# Altium schematic sheet power_SCH1.SchDoc
size B; Organization: CWRUbotix; Address1: 10900 Euclid Avenue; Address2: Cleveland, OH 44106; Address3: USA
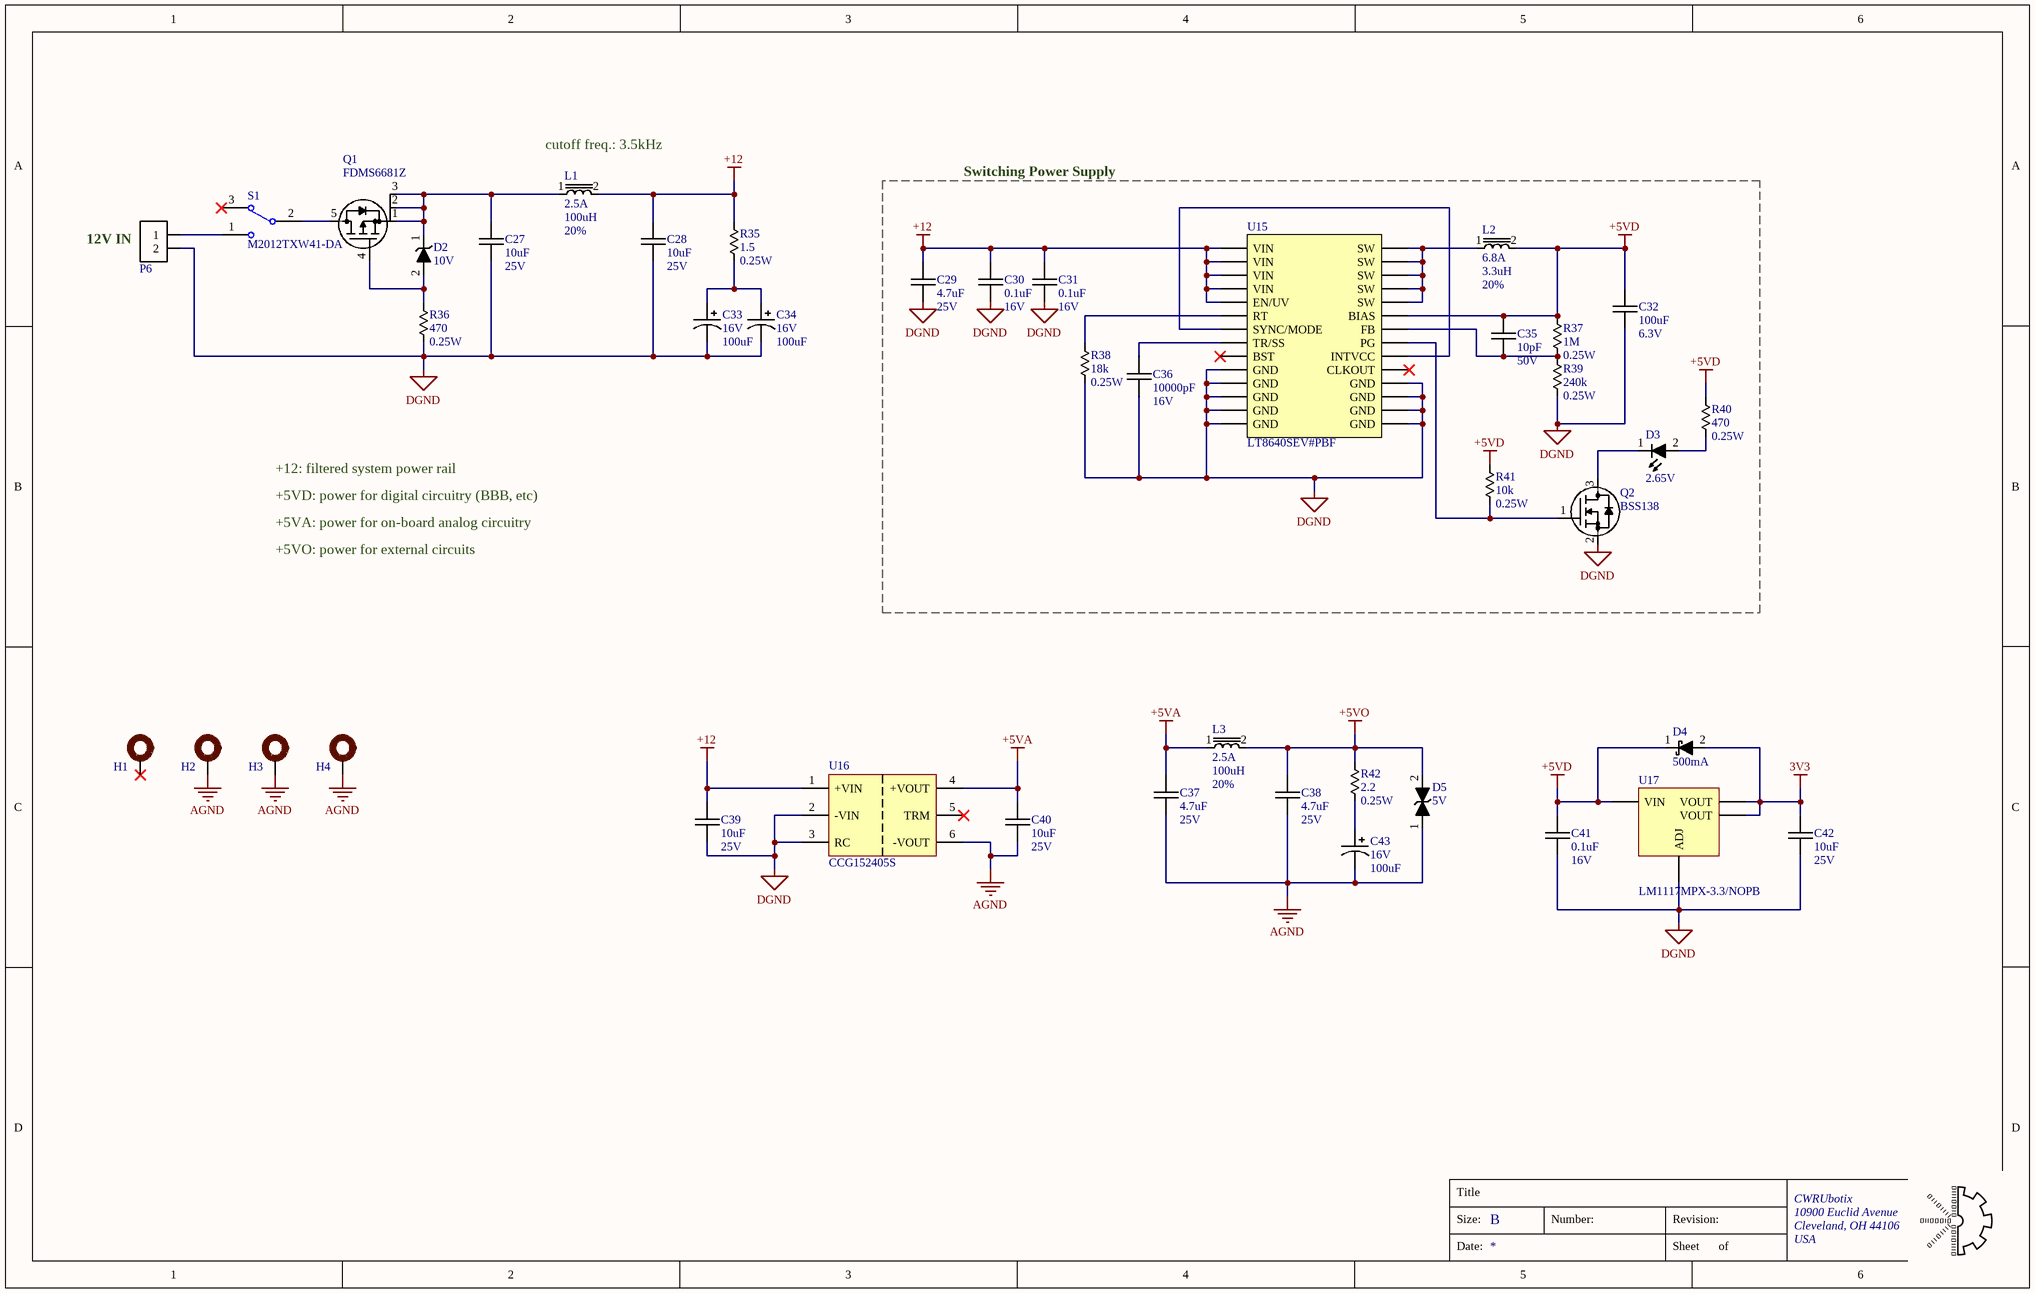
[diagram p0: power_SCH1.SchDoc]

## Parts
C27  Capacitance: 10uF  Voltage Rating: 25V  [chip_1206]  (hidden comment: cap_single_np)
C28  Capacitance: 10uF  Voltage Rating: 25V  [chip_1206]  (hidden comment: cap_single_np)
C29  Capacitance: 4.7uF  Voltage Rating: 25V  [chip_0805]  (hidden comment: cap_single_np)
C30  Capacitance: 0.1uF  Voltage Rating: 16V  [chip_0603]  (hidden comment: cap_single_np)
C31  Capacitance: 0.1uF  Voltage Rating: 16V  [chip_0603]  (hidden comment: cap_single_np)
C32  Capacitance: 100uF  Voltage Rating: 6.3V  [chip_1206]  (hidden comment: cap_single_np)
C33  Voltage Rating: 16V  Capacitance: 100uF  [chip_2917_AVX_TAJD]  (hidden comment: cap_single_p)
C34  Voltage Rating: 16V  Capacitance: 100uF  [chip_2917_AVX_TAJD]  (hidden comment: cap_single_p)
C35  Capacitance: 10pF  Voltage Rating: 50V  [chip_0603]  (hidden comment: cap_single_np)
C36  Capacitance: 10000pF  Voltage Rating: 16V  [chip_0603]  (hidden comment: cap_single_np)
C37  Capacitance: 4.7uF  Voltage Rating: 25V  [chip_0805]  (hidden comment: cap_single_np)
C38  Capacitance: 4.7uF  Voltage Rating: 25V  [chip_0805]  (hidden comment: cap_single_np)
C39  Capacitance: 10uF  Voltage Rating: 25V  [chip_1206]  (hidden comment: cap_single_np)
C40  Capacitance: 10uF  Voltage Rating: 25V  [chip_1206]  (hidden comment: cap_single_np)
C41  Capacitance: 0.1uF  Voltage Rating: 16V  [chip_0603]  (hidden comment: cap_single_np)
C42  Capacitance: 10uF  Voltage Rating: 25V  [chip_1206]  (hidden comment: cap_single_np)
C43  Voltage Rating: 16V  Capacitance: 100uF  [chip_2917_AVX_TAJD]  (hidden comment: cap_single_p)
D2  Reverse Breakdown Voltage: 10V  [sod323_0]  (hidden comment: diode_1)
D3  Forward Voltage: 2.65V  [chip_0603]  (hidden comment: diode_4)
D4  Current Rating: 500mA  [sod323_0]  (hidden comment: diode_2)
D5  Reverse Breakdown Voltage: 5V  [do-214ac]  (hidden comment: diode_5)
H1  mounting_hole_0  [#8-32_SOCKET_HEAD]  (value not drawn)
H2  mounting_hole_0  [#8-32_SOCKET_HEAD]  (value not drawn)
H3  mounting_hole_0  [#8-32_SOCKET_HEAD]  (value not drawn)
H4  mounting_hole_0  [#8-32_SOCKET_HEAD]  (value not drawn)
L1  Current Rating: 2.5A  Inductance: 100uH  Tolerance: 20%  [WURTH_7447709101]  (hidden comment: ind_1)
L2  Current Rating: 6.8A  Inductance: 3.3uH  Tolerance: 20%  [TDK_SPM6530]  (hidden comment: ind_1)
L3  Current Rating: 2.5A  Inductance: 100uH  Tolerance: 20%  [WURTH_7447709101]  (hidden comment: ind_1)
P6  conn-2x1_0  [TERM_3.50MM_2x1_0]  (value not drawn)
Q1  Manufacturer PN: FDMS6681Z  [PQFN-8-5x6]  (hidden comment: p-mosfet_3)
Q2  Manufacturer PN: BSS138  [sot-23-3]  (hidden comment: n-mosfet_1)
R35  Resistance: 1.5  Power Rating: 0.25W  [chip_0805]  (hidden comment: res_single)
R36  Resistance: 470  Power Rating: 0.25W  [chip_0603]  (hidden comment: res_single)
R37  Resistance: 1M  Power Rating: 0.25W  [chip_0603]  (hidden comment: res_single)
R38  Resistance: 18k  Power Rating: 0.25W  [chip_0603]  (hidden comment: res_single)
R39  Resistance: 240k  Power Rating: 0.25W  [chip_0603]  (hidden comment: res_single)
R40  Resistance: 470  Power Rating: 0.25W  [chip_0603]  (hidden comment: res_single)
R41  Resistance: 10k  Power Rating: 0.25W  [chip_0603]  (hidden comment: res_single)
R42  Resistance: 2.2  Power Rating: 0.25W  [chip_0805]  (hidden comment: res_single)
S1  Manufacturer PN: M2012TXW41-DA  [M2012TXG41-DC]  (hidden comment: SW-SPDT)
U15  Manufacturer PN: LT8640SEV#PBF  [LQFN-24_0]  (hidden comment: LT8640S)
U16  Manufacturer PN: CCG152405S  [CCG15]  (hidden comment: CCG15)
U17  Manufacturer PN: LM1117MPX-3.3/NOPB  [sot-223-4]  (hidden comment: LM1117)

## Blocks framed on the sheet
Switching Power Supply: C29-C32 C35 C36 D3 L2 Q2 R37-R41 U15

## Nets
3V3: C42.1 D4.2 U17.2(VOUT) U17.4(VOUT)
+5VA: C37.1 C40.1 L3.1 U16.4(+VOUT)
+5VD: C32.1 C35.1 C41.1 D4.1 L2.2 R37.1 R40.2 R41.1 U15.1(BIAS) U17.3(VIN)
+5VO: C38.1 D5.2 L3.2 R42.1
+12: C28.1 C29.1 C30.1 C31.1 C39.1 L1.2 R35.1 U15.5(VIN) U15.6(VIN) U15.13(VIN) U15.14(VIN) U15.17(EN/UV) U16.1(+VIN)
AGND: C37.2 C38.2 C40.2 C43.2 D5.1 H2.0(A) H3.0(A) H4.0(A) U16.6(-VOUT)
DGND: C27.2 C28.2 C29.2 C30.2 C31.2 C32.2 C33.2 C34.2 C36.2 C39.2 C41.2 C42.2 P6.2 Q2.2(S) R36.2 R38.2 R39.2 U15.3(GND) U15.4(GND) U15.15(GND) U15.16(GND) U15.25(GND) U15.26(GND) U15.27(GND) U15.28(GND) U16.2(-VIN) U16.3(RC) U17.1(ADJ)
NetC27_1: C27.1 D2.1 L1.1 Q1.1(S) Q1.2(S) Q1.3(S)
NetC33_1: C33.1 C34.1 R35.2
NetC35_2: C35.2 R37.2 R39.1 U15.24(FB)
NetC36_1: C36.1 U15.21(TR/SS)
NetC43_1: C43.1 R42.2
NetD2_2: D2.2 Q1.4(G) R36.1
NetD3_1: D3.1 Q2.3(D)
NetD3_2: D3.2 R40.1
NetL2_1: L2.1 U15.8(SW) U15.9(SW) U15.10(SW) U15.11(SW) U15.12(SW)
NetP6_1: P6.1 S1.1
NetQ1_5: Q1.5(D) S1.2
NetQ2_1: Q2.1(G) R41.2 U15.23(PG)
NetR38_1: R38.1 U15.18(RT)
NetU15_2: U15.2(INTVCC) U15.20(SYNC/MODE)

Not connected (* = marked no-connect by the designer): H1 0(A)*; S1 3*; U15 7(BST)* 19(CLKOUT)*; U16 5(TRM)*

## Notes on the sheet
- (near L1) cutoff freq.: 3.5kHz
- (near P6) 12V IN
- +12: filtered system power rail
- +5VD: power for digital circuitry (BBB, etc)
- +5VO: power for external circuits
- +5VA: power for on-board analog circuitry
- Title
- Size:
- B
- Number:
- Revision:
- Date:
- Sheet
- of

## Library data of the parts
C27 C28 C39 C40 C42 = CAP-00539: CAP, 10uF, ±10%, 25V, X7R, 1206; Manufacturer: Samsung; Manufacturer PN: CL31B106KAHNNNE; Tolerance: ±10%; Part Number: CAP-00539; Type: X7R
C29 C37 C38 = CAP-00128: CAP, 4.7uF, 10%, 25V, X7R, 0805; Manufacturer: Murata; Manufacturer PN: GRM21BR71E475KA73L; Tolerance: 10%; Part Number: CAP-00128; Type: X7R
C30 C31 C41 = CAP-00542: CAP, 0.1uF, ±10%, 16V, X7R, 0603; Manufacturer: Murata; Tolerance: ±10%; Part Number: CAP-00542; Type: X7R
C32 = CAP-00551: CAP, 100uF, ±20%, 6.3V, X5R, 1206; Manufacturer: Samsung Electro-Mechanics; Manufacturer PN: CL31A107MQHNNNE; Tolerance: ±20%; Part Number: CAP-00551; Type: X5R; Cost: $0.64
C33 C34 C43 = CAP-00550: CAP, 100uF, ±10%, 16V, Tantalum, 2917; Manufacturer: AVX; Manufacturer PN: TAJD107K016RNJ; Tolerance: ±10%; Part Number: CAP-00550; Type: Tantalum; Cost: $0.94
C35 = CAP-00471: CAP, 10pF, ±2%, 50V, C0G, 0603; Manufacturer: Murata; Manufacturer PN: GRM1885C1H100GA01D; Tolerance: ±2%; Part Number: CAP-00471; Type: C0G
C36 = CAP-00543: CAP, 10000pF, ±10%, 16V, X7R, 0603; Tolerance: ±10%; Part Number: CAP-00543; Type: X7R
D2 = DIO-00019: Dio Zen, 10V, 2%, 200mW, SOD-323; Manufacturer: ON Semi; Manufacturer PN: MM3Z10VST1G; Forward Voltage: 900mV; Type: Zener; Part Number: DIO-00019; Tolerance: 2%; Power Rating: 200mW
D3 = DIO-00049: LED, Blue, 0603, Low current, HELI2 Series; Manufacturer: Kingbright; Manufacturer PN: APT1608LVBC/D; Reverse Breakdown Voltage: 5V; Current Rating: 30mA; Power Rating: 120mW; Type: LED; Part Number: DIO-00049; Cost: 0.58
D4 = DIO-00000: Dio Shtky, 500mA, 0.62V, 30V, SOD-323; Manufacturer: ON Semi; Manufacturer PN: NSR0530HT1G; Forward Voltage: 620mV; Type: Schottky; Reverse Breakdown Voltage: 30V; Part Number: DIO-00000
D5 = DIO-00036: TVS, 5V, 400W; Manufacturer: ST; Manufacturer PN: SMAJ5.0A-TR; Type: TVS; Part Number: DIO-00036; Power Rating: 400W
H1-H4 = MISC-00027: #8-32 Mounting Hole for Socket Head Cap Screw; Part Number: MISC-00027
L1 L3 = MAG-00102: Ind, 100uH, 20%, 2.5A, 0.11 Ohm; Manufacturer: Wurth; Manufacturer PN: 7447709101; DCR: 110mOhm; Part Number: MAG-00102; Cost: 2.41; Weight: 7
L2 = MAG-00093: Ind, 3.3uH, 20%, 6.8A, EP5; Manufacturer: TDK; Manufacturer PN: SPM6530T-3R3M; DCR: 29.7 mOhm; Part Number: MAG-00093; Cost: 1.41; Weight: 0.7
P6 = CONN-00023: Term Blk, 2 Pos, 16A, 3.5mm Pitch; Manufacturer: Phoenix Contact; Manufacturer PN: 1861933; Positions per level: 2; Levels: 1; Current: 16; Part Number: CONN-00023; Type: Terminal Block; Cost: 0.79
Q1 = XSTR-00026: XSTR PMOS, 21.1A, 30V, Vgs 3V, PQFN8 5X6; Manufacturer: ON Semi; Max Power: 73W; Type: PFET; Max Current: 21.1A; Max Voltage: 30V; Part Number: XSTR-00026; Vgs/Vce: 3V; Cost: 1.82
Q2 = XSTR-00017: XSTR NMOS, 220mA, 50V, Vgs 1.3V, SOT-23-3; Manufacturer: ON Semi; Max Power: 360mW; Type: NFET; Max Current: 220mA; Max Voltage: 50V; Part Number: XSTR-00017; Vgs/Vce: 1.3V; Cost: 0.31
R35 = RES-00600: RES SMD 1.5 OHM 1% 1/4W 0805; Tolerance: 1%; Part Number: RES-00600
R36 R40 = RES-00236: RES SMD 470 OHM 1% 1/4W 0603; Manufacturer: Panasonic; Manufacturer PN: ERJ-PA3F4700V; Tolerance: 1%; Part Number: RES-00236
R37 = RES-00362: RES SMD 1M OHM 1% 1/4W 0603; Manufacturer: Panasonic; Manufacturer PN: ERJ-PA3F1004V; Tolerance: 1%; Part Number: RES-00362
R38 = RES-00356: RES SMD 18K OHM 1% 1/4W 0603; Manufacturer: Panasonic; Manufacturer PN: ERJ-PA3F1802V; Tolerance: 1%; Part Number: RES-00356
R39 = RES-00397: RES SMD 240K OHM 1% 1/4W 0603; Manufacturer: Panasonic; Manufacturer PN: ERJ-PA3F2403V; Tolerance: 1%; Part Number: RES-00397
R41 = RES-00306: RES SMD 10K OHM 1% 1/4W 0603; Manufacturer: Panasonic; Manufacturer PN: ERJ-PA3F1002V; Tolerance: 1%; Part Number: RES-00306; Cost: 0.144
R42 = RES-00601: RES SMD 2.2 OHM 1% 1/4W 0805; Tolerance: 1%; Part Number: RES-00601
S1 = MISC-00009: Switch, SPDT, Rocker, Thru-hole, Right-angle; Manufacturer: NKK Switches; Current Rating: *A; ComponentLink1Description: Manufacturer Link; ComponentLink1URL: http://www.apem.com; Part Number: MISC-00009; Cost: 5.1
U15 = PWREG-00013: SW Reg, Silent Switcher 2, Low EMI; Manufacturer: Analog Devices; Voltage Range In: 3 - 42V; Voltage Range Out: 0.97 - 42V; Max Current: 6A; Frequency: 200kHz-3MHz; Reg Type: SW Buck; Fixed/Adj: Adj; Part Number: PWREG-00013; Cost: 11.15
U16 = PWREG-00021: Module, Isolated, 5V, 3A; Manufacturer: TDK-Lambda; Voltage Range In: 9 - 36V; Fixed/Adj: Fixed; Part Number: PWREG-00021; Voltage Range Out: 5V; Max Current: 3A; Weight: 20
U17 = PWREG-00018: REG, Linear, Fixed 3V3, 800mA, SOT-223; Manufacturer: TI; Voltage Range In: 4.5 - 15V; Voltage Range Out: 3.3V; Part Number: PWREG-00018; Max Current: 800mA; Reg Type: Linear; Fixed/Adj: Fixed; Cost: 1.14